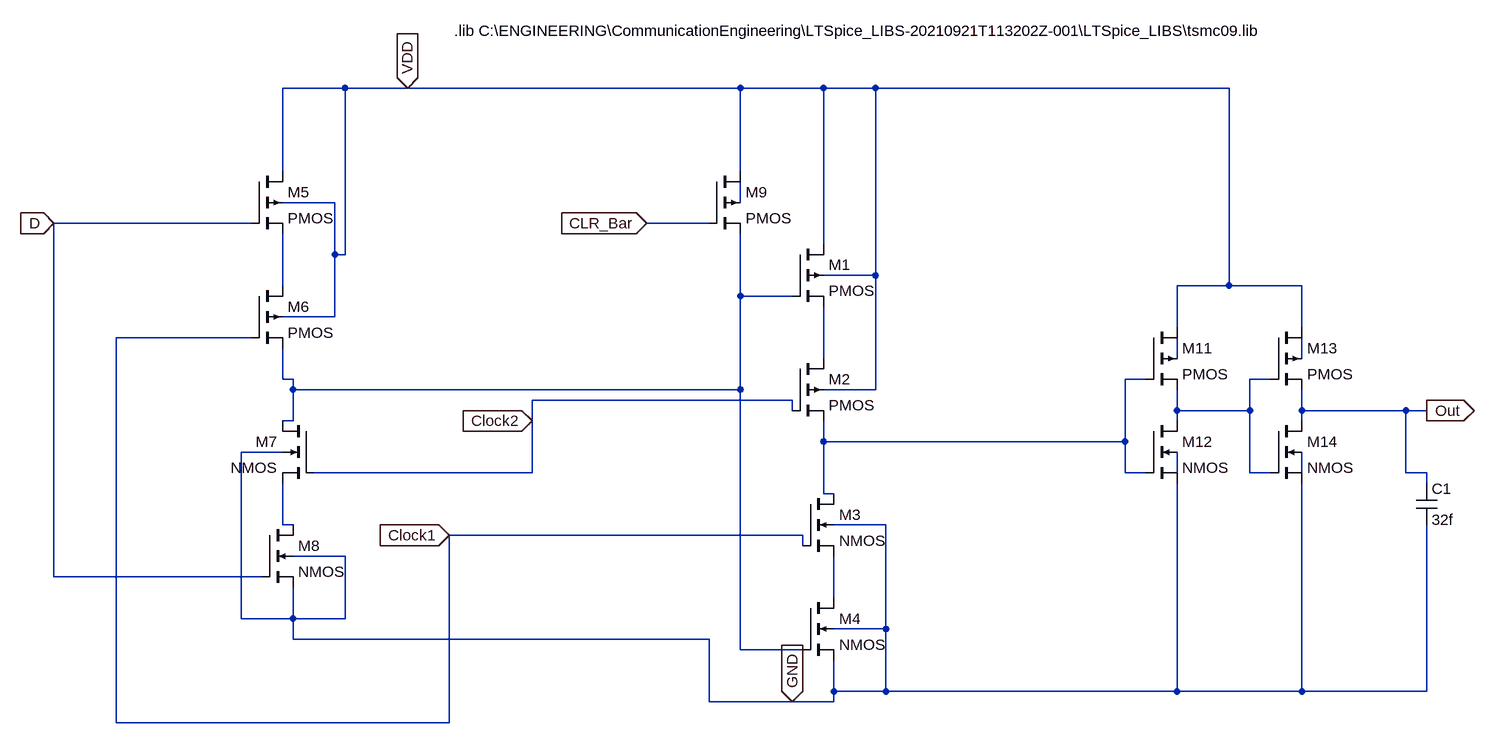
[diagram p0: schematic d_flip_flop_440_220_buffer_clr3EXP.asc]
d_flip_flop_440_220_buffer_clr3EXP.asc, the LTspice schematic file:
Version 4
SHEET 1 1644 1068
WIRE -240 64 -336 64
WIRE -144 64 -240 64
WIRE 368 64 -144 64
WIRE 496 64 368 64
WIRE 576 64 496 64
WIRE 1120 64 576 64
WIRE -336 192 -336 64
WIRE 368 192 368 64
WIRE -256 240 -336 240
WIRE 368 240 368 208
WIRE -384 272 -688 272
WIRE 320 272 224 272
WIRE 496 304 496 64
WIRE -256 320 -256 240
WIRE -240 320 -240 64
WIRE -240 320 -256 320
WIRE 576 352 576 64
WIRE 576 352 496 352
WIRE -336 368 -336 288
WIRE 1120 368 1120 64
WIRE 1120 368 1040 368
WIRE 1232 368 1120 368
WIRE 368 384 368 288
WIRE 448 384 368 384
WIRE -256 416 -256 320
WIRE -256 416 -336 416
WIRE 1040 432 1040 368
WIRE 1232 432 1232 368
WIRE -384 448 -592 448
WIRE 496 480 496 400
WIRE 1040 480 1040 448
WIRE 1232 480 1232 448
WIRE -336 512 -336 464
WIRE -320 512 -336 512
WIRE 992 512 960 512
WIRE 1184 512 1152 512
WIRE -320 528 -320 512
WIRE 368 528 368 384
WIRE 368 528 -320 528
WIRE 576 528 576 352
WIRE 576 528 496 528
WIRE 448 544 48 544
WIRE 448 560 448 544
WIRE 1040 560 1040 528
WIRE 1152 560 1152 512
WIRE 1152 560 1040 560
WIRE 1232 560 1232 528
WIRE 1392 560 1232 560
WIRE 1424 560 1392 560
WIRE -320 576 -320 528
WIRE -320 576 -336 576
WIRE 48 576 48 544
WIRE 1040 576 1040 560
WIRE 1232 576 1232 560
WIRE 496 608 496 576
WIRE 960 608 960 512
WIRE 960 608 496 608
WIRE -336 624 -400 624
WIRE 48 656 48 576
WIRE 48 656 -288 656
WIRE 960 656 960 608
WIRE 992 656 960 656
WIRE 1040 656 1040 624
WIRE 1152 656 1152 560
WIRE 1184 656 1152 656
WIRE 1232 656 1232 624
WIRE 1392 656 1392 560
WIRE 1424 656 1392 656
WIRE 1424 672 1424 656
WIRE 496 688 496 608
WIRE 512 688 496 688
WIRE -336 736 -336 672
WIRE -320 736 -336 736
WIRE 592 736 512 736
WIRE 464 752 -80 752
WIRE 464 768 464 752
WIRE -240 784 -320 784
WIRE -688 816 -688 272
WIRE -368 816 -688 816
WIRE 512 848 512 784
WIRE -400 880 -400 624
WIRE -320 880 -320 832
WIRE -320 880 -400 880
WIRE -240 880 -240 784
WIRE -240 880 -320 880
WIRE 592 896 592 736
WIRE 592 896 512 896
WIRE -320 912 -320 880
WIRE 320 912 -320 912
WIRE 368 928 368 528
WIRE 464 928 368 928
WIRE 512 992 512 944
WIRE 592 992 592 896
WIRE 592 992 512 992
WIRE 1040 992 1040 672
WIRE 1040 992 592 992
WIRE 1232 992 1232 672
WIRE 1232 992 1040 992
WIRE 1424 992 1424 736
WIRE 1424 992 1232 992
WIRE 320 1008 320 912
WIRE 448 1008 320 1008
WIRE 512 1008 512 992
WIRE 512 1008 448 1008
WIRE -592 1040 -592 448
WIRE -80 1040 -80 752
WIRE -80 1040 -592 1040
FLAG -688 272 D
IOPIN -688 272 In
FLAG -80 752 Clock1
IOPIN -80 752 In
FLAG 48 576 Clock2
IOPIN 48 576 In
FLAG 1424 560 Out
IOPIN 1424 560 Out
FLAG 224 272 CLR_Bar
IOPIN 224 272 In
FLAG -144 64 VDD
IOPIN -144 64 In
FLAG 448 1008 GND
IOPIN 448 1008 In
SYMBOL pmos4 448 304 R0
SYMATTR InstName M1
SYMATTR Value2 l=90n w=440n
SYMBOL pmos4 448 480 R0
SYMATTR InstName M2
SYMATTR Value2 l=90n w=440n
SYMBOL nmos4 464 688 R0
SYMATTR InstName M3
SYMATTR Value2 l=90n w=220n
SYMBOL nmos4 464 848 R0
SYMATTR InstName M4
SYMATTR Value2 l=90n w=220n
SYMBOL cap 1408 672 R0
SYMATTR InstName C1
SYMATTR Value 32f
SYMBOL pmos4 -384 192 R0
SYMATTR InstName M5
SYMATTR Value2 l=90n w=440n
SYMBOL pmos4 -384 368 R0
SYMATTR InstName M6
SYMATTR Value2 l=90n w=440n
SYMBOL nmos4 -288 576 M0
SYMATTR InstName M7
SYMATTR Value2 l=90n w=220n
SYMBOL nmos4 -368 736 R0
SYMATTR InstName M8
SYMATTR Value2 l=90n w=220n
SYMBOL pmos4 320 192 R0
SYMATTR InstName M9
SYMATTR Value2 l=90n w=440n
SYMBOL pmos4 992 432 R0
SYMATTR InstName M11
SYMATTR Value2 l=90n w=440n
SYMBOL nmos4 992 576 R0
SYMATTR InstName M12
SYMATTR Value2 l=90n w=220n
SYMBOL pmos4 1184 432 R0
SYMATTR InstName M13
SYMATTR Value2 l=90n w=440n
SYMBOL nmos4 1184 576 R0
SYMATTR InstName M14
SYMATTR Value2 l=90n w=220n
TEXT -72 -24 Left 2 !.lib C:\\ENGINEERING\\CommunicationEngineering\\LTSpice_LIBS-20210921T113202Z-001\\LTSpice_LIBS\\tsmc09.lib

The netlist it stands for:
* d_flip_flop_440_220_buffer_clr3EXP.asc
M1 VDD N003 N004 VDD PMOS l=90n w=440n
M2 N004 Clock2 N007 VDD PMOS l=90n w=440n
M3 N007 Clock1 N012 GND NMOS l=90n w=220n
M4 N012 N003 GND GND NMOS l=90n w=220n
C1 Out GND 32f
M5 VDD D N002 VDD PMOS l=90n w=440n
M6 N002 Clock1 N003 VDD PMOS l=90n w=440n
M7 N003 Clock2 N011 GND NMOS l=90n w=220n
M8 N011 D GND GND NMOS l=90n w=220n
M9 VDD CLR_Bar N003 N001 PMOS l=90n w=440n
M11 VDD N007 N008 N005 PMOS l=90n w=440n
M12 N008 N007 GND N009 NMOS l=90n w=220n
M13 VDD N008 Out N006 PMOS l=90n w=440n
M14 Out N008 GND N010 NMOS l=90n w=220n
.model NMOS NMOS
.model PMOS PMOS
.lib standard.mos
.lib C:\ENGINEERING\CommunicationEngineering\LTSpice_LIBS-20210921T113202Z-001\LTSpice_LIBS\tsmc09.lib
.backanno
.end